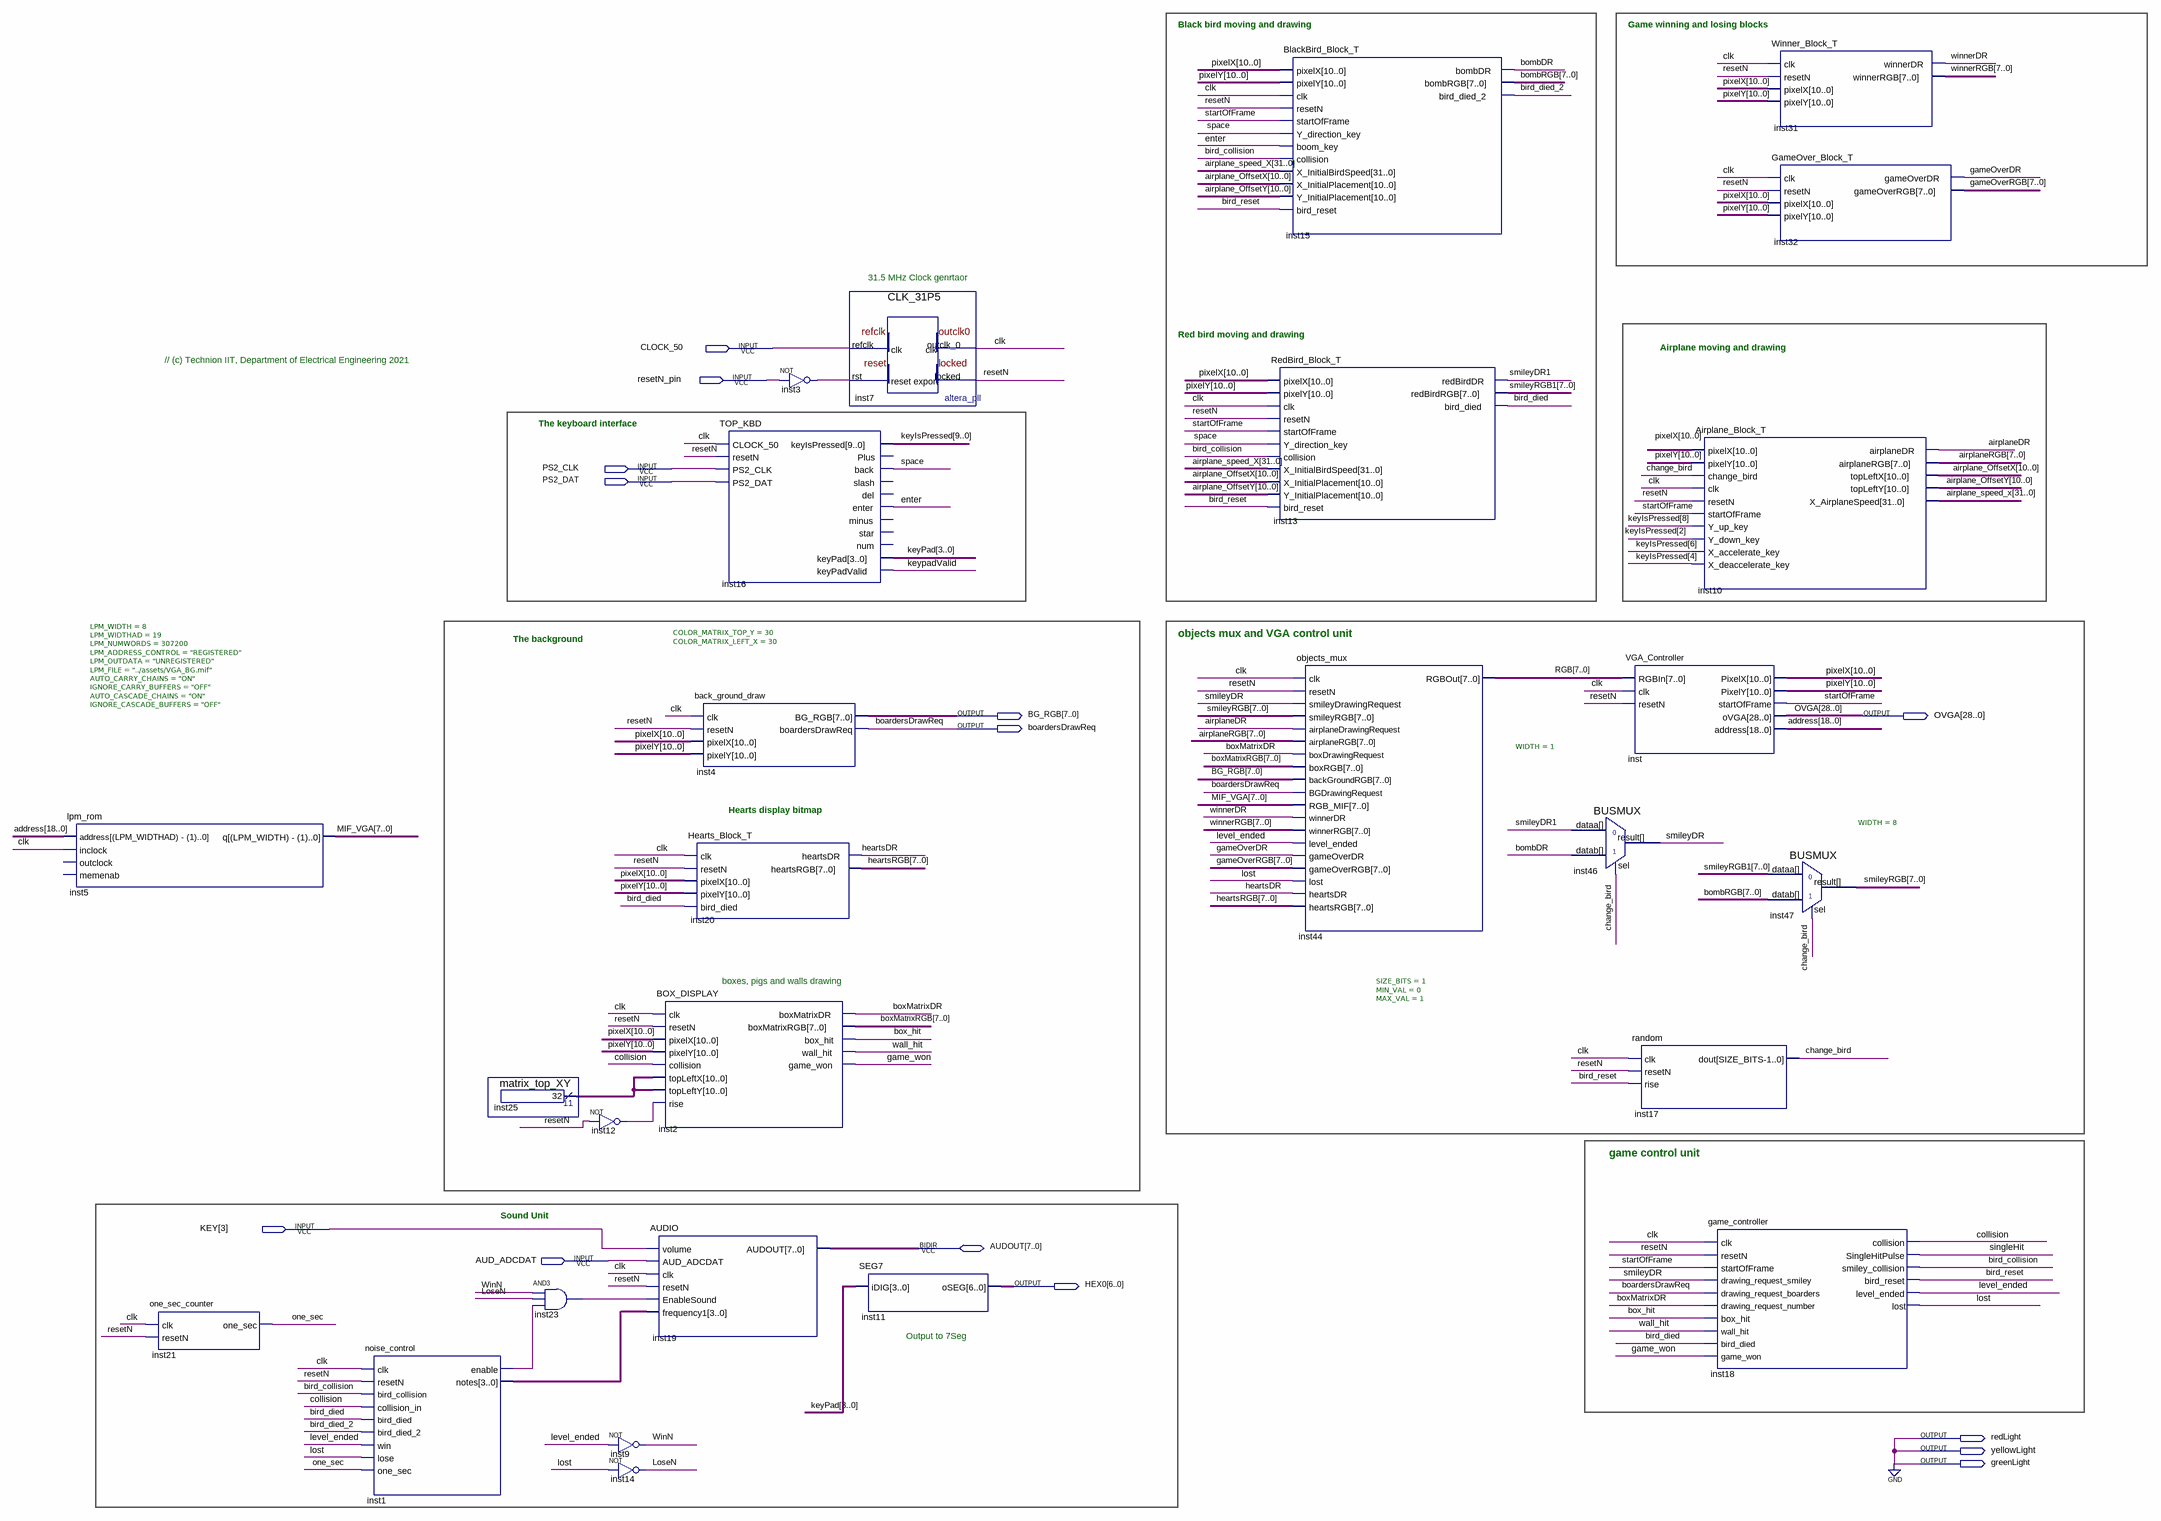
[diagram p0: schematic sheet]
// Quartus schematic TOP_VGA_DEMO_KBD.bdf as structural Verilog: 27 symbols, 14 pins
module TOP_VGA_DEMO_KBD (
  input  CLOCK_50,
  input  resetN_pin,
  input  PS2_CLK,
  input  PS2_DAT,
  input  [3:3] KEY,
  input  AUD_ADCDAT,
  inout  [7:0] AUDOUT,
  output [7:0] BG_RGB,
  output [28:0] OVGA,
  output boardersDrawReq,
  output [6:0] HEX0,
  output redLight,
  output yellowLight,
  output greenLight
);

  wire airplaneDR, bird_collision, bird_died, bird_died_2, bird_reset, bombDR, box_hit, boxMatrixDR,
       change_bird, clk, collision, enter, game_won, gameOverDR, heartsDR, inst1_enable, inst3_out,
       inst12_out, inst23_out, keypadValid, level_ended, LoseN, lost, one_sec, resetN, singleHit, smileyDR,
       smileyDR1, space, startOfFrame, wall_hit, WinN, winnerDR;
  wire [3:0] inst1_notes, keyPad;
  wire [7:0] airplaneRGB, bombRGB, boxMatrixRGB, gameOverRGB, heartsRGB, MIF_VGA, RGB, smileyRGB, smileyRGB1,
       winnerRGB;
  wire [9:0] keyIsPressed;
  wire [10:0] airplane_OffsetX, airplane_OffsetY, inst25_result, pixelX, pixelY;
  wire [18:0] address;
  wire [31:0] airplane_speed_X;

  lpm_rom #(.LPM_WIDTH(8), .LPM_WIDTHAD(19), .LPM_NUMWORDS(307200), .LPM_ADDRESS_CONTROL("REGISTERED"), .LPM_OUTDATA("UNREGISTERED"), .LPM_FILE("../assets/VGA_BG.mif"), .AUTO_CARRY_CHAINS("ON"), .IGNORE_CARRY_BUFFERS("OFF"), .AUTO_CASCADE_CHAINS("ON"), .IGNORE_CASCADE_BUFFERS("OFF")) inst5 (
    .address(address), .inclock(clk), .q(MIF_VGA));  // open: outclock, memenab
  one_sec_counter inst21 (.clk(clk), .resetN(resetN), .one_sec(one_sec));
  noise_control inst1 (
    .clk(clk), .resetN(resetN), .bird_collision(bird_collision), .collision_in(collision),
    .bird_died(bird_died), .bird_died_2(bird_died_2), .win(level_ended), .lose(lost), .one_sec(one_sec),
    .enable(inst1_enable), .notes(inst1_notes));
  matrix_top_XY inst25 (.result(inst25_result));
  and inst23 (inst23_out, WinN, LoseN, inst1_enable);
  not inst12 (inst12_out, resetN);
  not inst9 (WinN, level_ended);
  not inst14 (LoseN, lost);
  Hearts_Block_T inst20 (
    .clk(clk), .resetN(resetN), .pixelX(pixelX), .pixelY(pixelY), .bird_died(bird_died), .heartsDR(heartsDR),
    .heartsRGB(heartsRGB));
  BOX_DISPLAY inst2 (
    .clk(clk), .resetN(resetN), .pixelX(pixelX), .pixelY(pixelY), .collision(collision),
    .topLeftX(inst25_result), .topLeftY(inst25_result), .rise(inst12_out), .boxMatrixDR(boxMatrixDR),
    .boxMatrixRGB(boxMatrixRGB), .box_hit(box_hit), .wall_hit(wall_hit), .game_won(game_won));
  AUDIO inst19 (
    .volume(KEY[3]), .AUD_ADCDAT(AUD_ADCDAT), .clk(clk), .resetN(resetN), .EnableSound(inst23_out),
    .frequency1(inst1_notes), .AUDOUT(AUDOUT));
  TOP_KBD inst16 (
    .CLOCK_50(clk), .resetN(resetN), .PS2_CLK(PS2_CLK), .PS2_DAT(PS2_DAT), .keyIsPressed(keyIsPressed),
    .back(space), .enter(enter), .keyPad(keyPad), .keyPadValid(keypadValid));  // open: Plus, slash, del, minus, star, num
  back_ground_draw #(.COLOR_MATRIX_TOP_Y(30), .COLOR_MATRIX_LEFT_X(30)) inst4 (
    .clk(clk), .resetN(resetN), .pixelX(pixelX), .pixelY(pixelY), .BG_RGB(BG_RGB),
    .boardersDrawReq(boardersDrawReq));
  not inst3 (inst3_out, resetN_pin);
  CLK_31P5 inst7 (.refclk(CLOCK_50), .rst(inst3_out), .outclk_0(clk), .locked(resetN));
  SEG7 inst11 (.iDIG(keyPad), .oSEG(HEX0));
  BlackBird_Block_T inst15 (
    .pixelX(pixelX), .pixelY(pixelY), .clk(clk), .resetN(resetN), .startOfFrame(startOfFrame),
    .Y_direction_key(space), .boom_key(enter), .collision(bird_collision),
    .X_InitialBirdSpeed(airplane_speed_X), .X_InitialPlacement(airplane_OffsetX),
    .Y_InitialPlacement(airplane_OffsetY), .bird_reset(bird_reset), .bombDR(bombDR), .bombRGB(bombRGB),
    .bird_died_2(bird_died_2));
  RedBird_Block_T inst13 (
    .pixelX(pixelX), .pixelY(pixelY), .clk(clk), .resetN(resetN), .startOfFrame(startOfFrame),
    .Y_direction_key(space), .collision(bird_collision), .X_InitialBirdSpeed(airplane_speed_X),
    .X_InitialPlacement(airplane_OffsetX), .Y_InitialPlacement(airplane_OffsetY), .bird_reset(bird_reset),
    .redBirdDR(smileyDR1), .redBirdRGB(smileyRGB1), .bird_died(bird_died));
  objects_mux inst44 (
    .clk(clk), .resetN(resetN), .smileyDrawingRequest(smileyDR), .smileyRGB(smileyRGB),
    .airplaneDrawingRequest(airplaneDR), .airplaneRGB(airplaneRGB), .boxDrawingRequest(boxMatrixDR),
    .boxRGB(boxMatrixRGB), .backGroundRGB(BG_RGB), .BGDrawingRequest(boardersDrawReq), .RGB_MIF(MIF_VGA),
    .winnerDR(winnerDR), .winnerRGB(winnerRGB), .level_ended(level_ended), .gameOverDR(gameOverDR),
    .gameOverRGB(gameOverRGB), .lost(lost), .heartsDR(heartsDR), .heartsRGB(heartsRGB), .RGBOut(RGB));
  BUSMUX #(.WIDTH(1)) inst46 (.datab(bombDR), .sel(change_bird), .dataa(smileyDR1), .result(smileyDR));
  VGA_Controller inst (
    .RGBIn(RGB), .clk(clk), .resetN(resetN), .PixelX(pixelX), .PixelY(pixelY), .startOfFrame(startOfFrame),
    .oVGA(OVGA), .address(address));
  random #(.SIZE_BITS(1), .MIN_VAL(0), .MAX_VAL(1)) inst17 (
    .clk(clk), .resetN(resetN), .rise(bird_reset), .dout(change_bird));
  Airplane_Block_T inst10 (
    .pixelX(pixelX), .pixelY(pixelY), .change_bird(change_bird), .clk(clk), .resetN(resetN),
    .startOfFrame(startOfFrame), .Y_up_key(keyIsPressed[8]), .Y_down_key(keyIsPressed[2]),
    .X_accelerate_key(keyIsPressed[6]), .X_deaccelerate_key(keyIsPressed[4]), .airplaneDR(airplaneDR),
    .airplaneRGB(airplaneRGB), .topLeftX(airplane_OffsetX), .topLeftY(airplane_OffsetY),
    .X_AirplaneSpeed(airplane_speed_X));
  game_controller inst18 (
    .clk(clk), .resetN(resetN), .startOfFrame(startOfFrame), .drawing_request_smiley(smileyDR),
    .drawing_request_boarders(boardersDrawReq), .drawing_request_number(boxMatrixDR), .box_hit(box_hit),
    .wall_hit(wall_hit), .bird_died(bird_died), .game_won(game_won), .collision(collision),
    .SingleHitPulse(singleHit), .smiley_collision(bird_collision), .bird_reset(bird_reset),
    .level_ended(level_ended), .lost(lost));
  Winner_Block_T inst31 (
    .clk(clk), .resetN(resetN), .pixelX(pixelX), .pixelY(pixelY), .winnerDR(winnerDR), .winnerRGB(winnerRGB));
  GameOver_Block_T inst32 (
    .clk(clk), .resetN(resetN), .pixelX(pixelX), .pixelY(pixelY), .gameOverDR(gameOverDR),
    .gameOverRGB(gameOverRGB));
  BUSMUX #(.WIDTH(8)) inst47 (.datab(bombRGB), .sel(change_bird), .dataa(smileyRGB1), .result(smileyRGB));

  assign greenLight = 1'b0;
  assign redLight = 1'b0;
  assign yellowLight = 1'b0;

  // Notes on the sheet:
  //   Black bird moving and drawing
  //   Game winning and losing blocks
  //   31.5 MHz Clock genrtaor
  //   Red bird moving and drawing
  //   Airplane moving and drawing
  //   // (c) Technion IIT, Department of Electrical Engineering 2021
  //   The keyboard interface
  //   objects mux and VGA control unit
  //   The background
  //   Hearts display bitmap
  //   boxes, pigs and walls drawing
  //   game control unit
  //   Sound Unit
  //   Output to 7Seg
endmodule
